# Altium schematic sheet Lights.SchDoc: LEDs
size A3; SheetNumber: 4; SheetTotal: 7
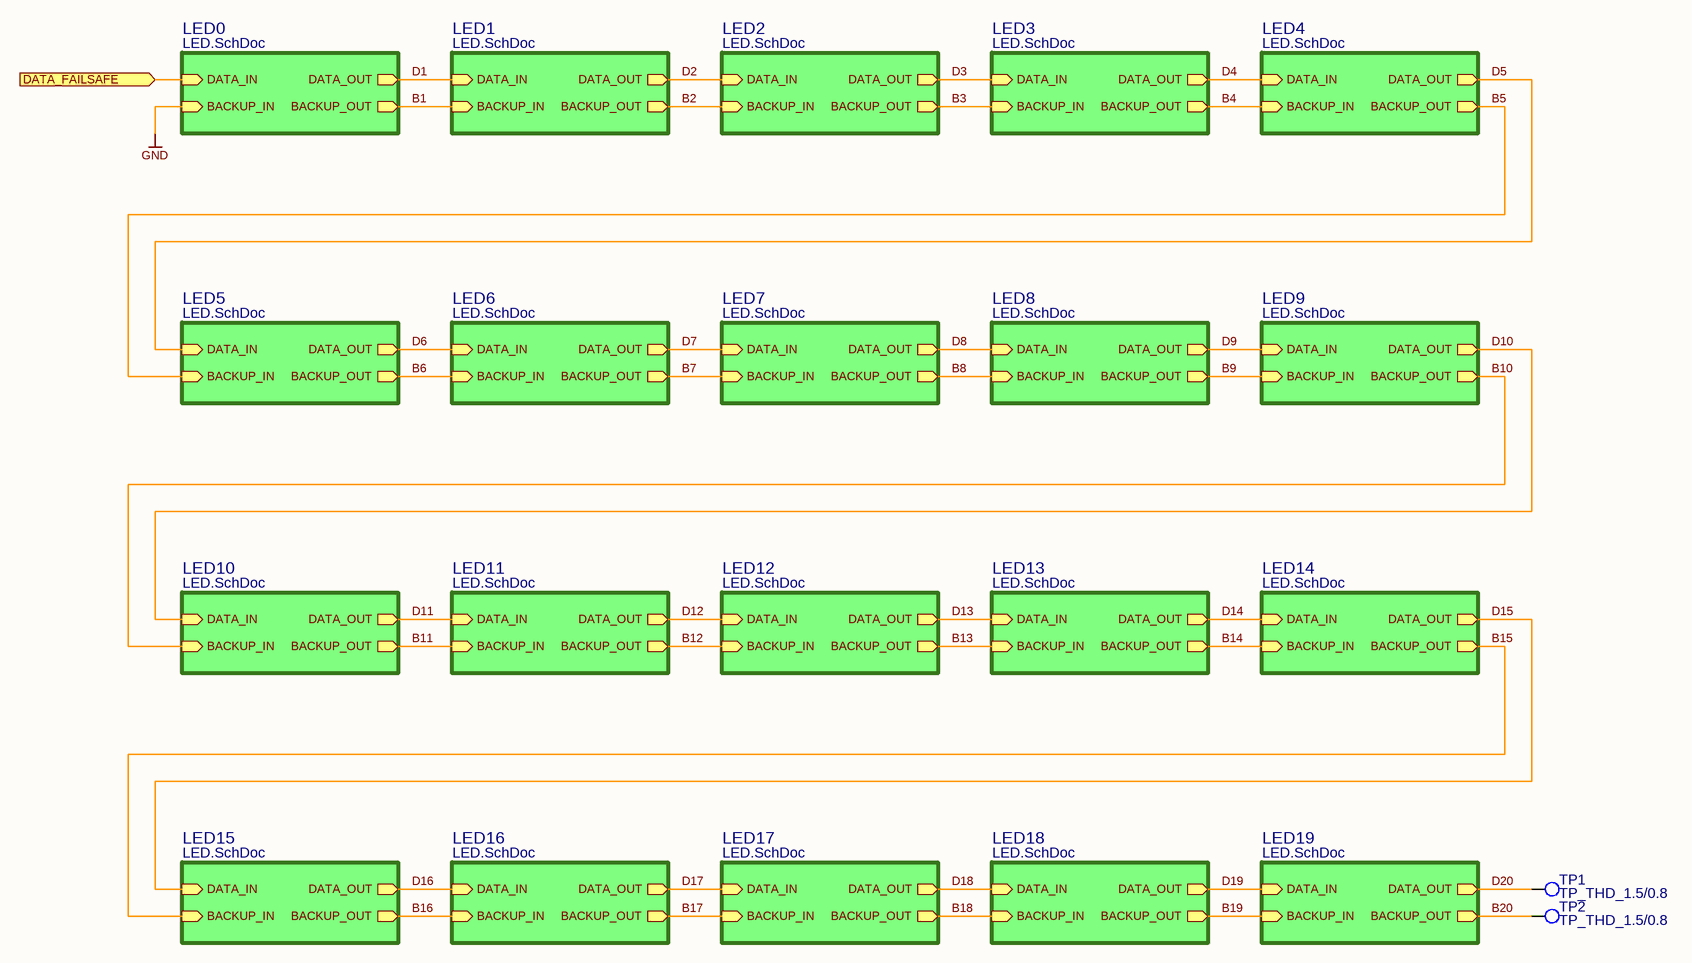
[diagram p0: Lights.SchDoc]

## Parts
TP1  TP_THD_1.5/0.8  [TP_THD_1.5/0.8]  (no BOM)
TP2  TP_THD_1.5/0.8  [TP_THD_1.5/0.8]  (no BOM)

## Sub-sheets
LED0 = LED.SchDoc: DATA_IN (in), BACKUP_IN (in), DATA_OUT (out), BACKUP_OUT (out)
LED1 = LED.SchDoc: DATA_IN (in), BACKUP_IN (in), DATA_OUT (out), BACKUP_OUT (out)
LED2 = LED.SchDoc: DATA_IN (in), BACKUP_IN (in), DATA_OUT (out), BACKUP_OUT (out)
LED3 = LED.SchDoc: DATA_IN (in), BACKUP_IN (in), DATA_OUT (out), BACKUP_OUT (out)
LED4 = LED.SchDoc: DATA_IN (in), BACKUP_IN (in), DATA_OUT (out), BACKUP_OUT (out)
LED5 = LED.SchDoc: DATA_IN (in), BACKUP_IN (in), DATA_OUT (out), BACKUP_OUT (out)
LED6 = LED.SchDoc: DATA_IN (in), BACKUP_IN (in), DATA_OUT (out), BACKUP_OUT (out)
LED7 = LED.SchDoc: DATA_IN (in), BACKUP_IN (in), DATA_OUT (out), BACKUP_OUT (out)
LED8 = LED.SchDoc: DATA_IN (in), BACKUP_IN (in), DATA_OUT (out), BACKUP_OUT (out)
LED9 = LED.SchDoc: DATA_IN (in), BACKUP_IN (in), DATA_OUT (out), BACKUP_OUT (out)
LED10 = LED.SchDoc: DATA_IN (in), BACKUP_IN (in), DATA_OUT (out), BACKUP_OUT (out)
LED11 = LED.SchDoc: DATA_IN (in), BACKUP_IN (in), DATA_OUT (out), BACKUP_OUT (out)
LED12 = LED.SchDoc: DATA_IN (in), BACKUP_IN (in), DATA_OUT (out), BACKUP_OUT (out)
LED13 = LED.SchDoc: DATA_IN (in), BACKUP_IN (in), DATA_OUT (out), BACKUP_OUT (out)
LED14 = LED.SchDoc: DATA_IN (in), BACKUP_IN (in), DATA_OUT (out), BACKUP_OUT (out)
LED15 = LED.SchDoc: DATA_IN (in), BACKUP_IN (in), DATA_OUT (out), BACKUP_OUT (out)
LED16 = LED.SchDoc: DATA_IN (in), BACKUP_IN (in), DATA_OUT (out), BACKUP_OUT (out)
LED17 = LED.SchDoc: DATA_IN (in), BACKUP_IN (in), DATA_OUT (out), BACKUP_OUT (out)
LED18 = LED.SchDoc: DATA_IN (in), BACKUP_IN (in), DATA_OUT (out), BACKUP_OUT (out)
LED19 = LED.SchDoc: DATA_IN (in), BACKUP_IN (in), DATA_OUT (out), BACKUP_OUT (out)

## Ports
DATA_FAILSAFE (in)

## Nets
GND: sheet LED0/BACKUP_IN
B1: sheet LED0/BACKUP_OUT, sheet LED1/BACKUP_IN
B2: sheet LED1/BACKUP_OUT, sheet LED2/BACKUP_IN
B3: sheet LED2/BACKUP_OUT, sheet LED3/BACKUP_IN
B4: sheet LED3/BACKUP_OUT, sheet LED4/BACKUP_IN
B5: sheet LED4/BACKUP_OUT, sheet LED5/BACKUP_IN
B6: sheet LED5/BACKUP_OUT, sheet LED6/BACKUP_IN
B7: sheet LED6/BACKUP_OUT, sheet LED7/BACKUP_IN
B8: sheet LED7/BACKUP_OUT, sheet LED8/BACKUP_IN
B9: sheet LED8/BACKUP_OUT, sheet LED9/BACKUP_IN
B10: sheet LED9/BACKUP_OUT, sheet LED10/BACKUP_IN
B11: sheet LED10/BACKUP_OUT, sheet LED11/BACKUP_IN
B12: sheet LED11/BACKUP_OUT, sheet LED12/BACKUP_IN
B13: sheet LED12/BACKUP_OUT, sheet LED13/BACKUP_IN
B14: sheet LED13/BACKUP_OUT, sheet LED14/BACKUP_IN
B15: sheet LED14/BACKUP_OUT, sheet LED15/BACKUP_IN
B16: sheet LED15/BACKUP_OUT, sheet LED16/BACKUP_IN
B17: sheet LED16/BACKUP_OUT, sheet LED17/BACKUP_IN
B18: sheet LED17/BACKUP_OUT, sheet LED18/BACKUP_IN
B19: sheet LED18/BACKUP_OUT, sheet LED19/BACKUP_IN
B20: TP2.1 ; sheet LED19/BACKUP_OUT
D1: sheet LED0/DATA_OUT, sheet LED1/DATA_IN
D2: sheet LED1/DATA_OUT, sheet LED2/DATA_IN
D3: sheet LED2/DATA_OUT, sheet LED3/DATA_IN
D4: sheet LED3/DATA_OUT, sheet LED4/DATA_IN
D5: sheet LED4/DATA_OUT, sheet LED5/DATA_IN
D6: sheet LED5/DATA_OUT, sheet LED6/DATA_IN
D7: sheet LED6/DATA_OUT, sheet LED7/DATA_IN
D8: sheet LED7/DATA_OUT, sheet LED8/DATA_IN
D9: sheet LED8/DATA_OUT, sheet LED9/DATA_IN
D10: sheet LED9/DATA_OUT, sheet LED10/DATA_IN
D11: sheet LED10/DATA_OUT, sheet LED11/DATA_IN
D12: sheet LED11/DATA_OUT, sheet LED12/DATA_IN
D13: sheet LED12/DATA_OUT, sheet LED13/DATA_IN
D14: sheet LED13/DATA_OUT, sheet LED14/DATA_IN
D15: sheet LED14/DATA_OUT, sheet LED15/DATA_IN
D16: sheet LED15/DATA_OUT, sheet LED16/DATA_IN
D17: sheet LED16/DATA_OUT, sheet LED17/DATA_IN
D18: sheet LED17/DATA_OUT, sheet LED18/DATA_IN
D19: sheet LED18/DATA_OUT, sheet LED19/DATA_IN
D20: TP1.1 ; sheet LED19/DATA_OUT
DATA_FAILSAFE: port DATA_FAILSAFE, sheet LED0/DATA_IN

## Notes on the sheet
- Date:
- Size:
- A3
- Schema:
- Layout:

## Library data of the parts
TP1 TP2 = TP_THD_1.5/0.8: THT Test Point 1.5/0.8mm; Manufacturer: NONE; Part Number: TP_THD_1.5/0.8